# Altium schematic sheet Interface - Debug.SchDoc
size A; SheetNumber: 7; SheetTotal: 11
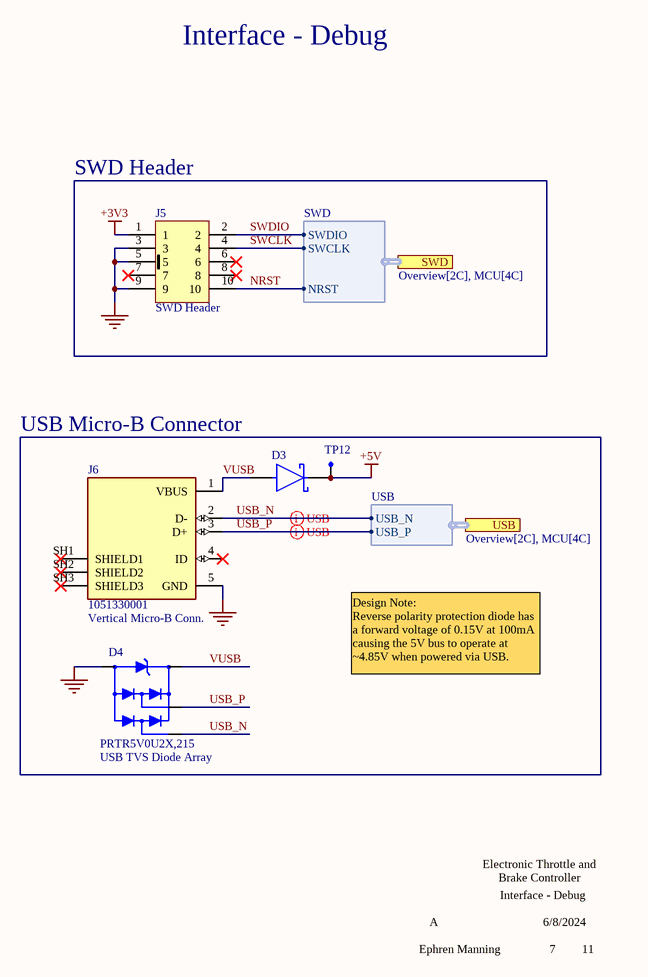
[diagram p0: Interface - Debug.SchDoc]

## Parts
D3  LSM115JE3/TR13  [DIOM4336X33N]  (value not drawn)
D4  PRTR5V0U2X,215  [SOT143B]
J5  SWD Header  [FCI_20021111-00010T4LF]
J6  1051330001  [MOLEX_1051330001]
TP12  SMD Testpoint  [SMD Testpoint-Footprint-1]  (value not drawn)

## Blocks framed on the sheet
SWD Header: J5
USB Micro-B Connector: D3 D4 J6 TP12

## Ports
SWD (harness SWD, see Overview[2C], MCU[4C]), USB (harness USB, see Overview[2C], MCU[4C])

## Harnesses
SWD: SWDIO, SWCLK, NRST
USB: USB_N, USB_P

## Nets
+3V3: J5.1
+5V: D3.2 TP12.1
GND: D4.1(P$1) J5.3 J5.5 J5.9 J6.5(GND)
NRST: J5.10 ; port SWD.NRST
SWCLK: J5.4 ; port SWD.SWCLK
SWDIO: J5.2 ; port SWD.SWDIO
USB_N: D4.3(P$3) J6.2(D-) ; port USB.USB_N
USB_P: D4.2(P$2) J6.3(D+) ; port USB.USB_P
VUSB: D3.1 D4.4(P$4) J6.1(VBUS)

Not connected (* = marked no-connect by the designer): J5 6* 7* 8*; J6 4(ID)* SH1(SHIELD1)* SH2(SHIELD2)* SH3(SHIELD3)*

## Layout directives
differential pair: USB_N, USB_P

## Notes on the sheet
- Interface - Debug
- Vertical Micro-B Conn.
- Design Note:
  Reverse polarity protection diode has a forward voltage of 0.15V at 100mA causing the 5V bus to operate at ~4.85V when powered via USB.
- (near D4) USB TVS Diode Array
- Electronic Throttle and
  Brake Controller
- A
- 6/8/2024
- Ephren Manning
- 7
- 11
- Project Title:
- Sheet Title:
- Revision:
- Date:
- Author:
- Sheet        of

## Library data of the parts
D3 = CMP-00073-1: 15V 1A Schottky Diode, Very Low Forward Voltage; Manufacturer 1: Microchip Technology; Digikey Part Number: 150-LSM115JE3/TR13CT-ND; Manufacturer Part Number 1: LSM115JE3/TR13
D4 = CMP-018-000000-5: Diode Array, ESD; Manufacturer 1: Nexperia USA Inc.; Manufacturer Part Number 1: PRTR5V0U2X,215; Digikey Part Number: 1727-3884-1-ND
J5 = CMP-118-000000-2: SWD Unshrouded Connector; Manufacturer 1: Amphenol ICC (FCI); Digikey Part Number: 609-3712-ND; Manufacturer Part Number 1: 20021111-00010T4LF
J6 = CMP-016-000000-6: Micro USB Type B 90 Degree Conn; Manufacturer 1: Molex; Manufacturer Part Number 1: 1051330001; Digikey Part Number: WM9734CT-ND
TP12 = CMP-00095-4: Flat 50x50mil Test Point